# Altium schematic sheet Sheet2.SchDoc
size A3; DocumentNumber: 2; SheetNumber: 2; SheetTotal: 7
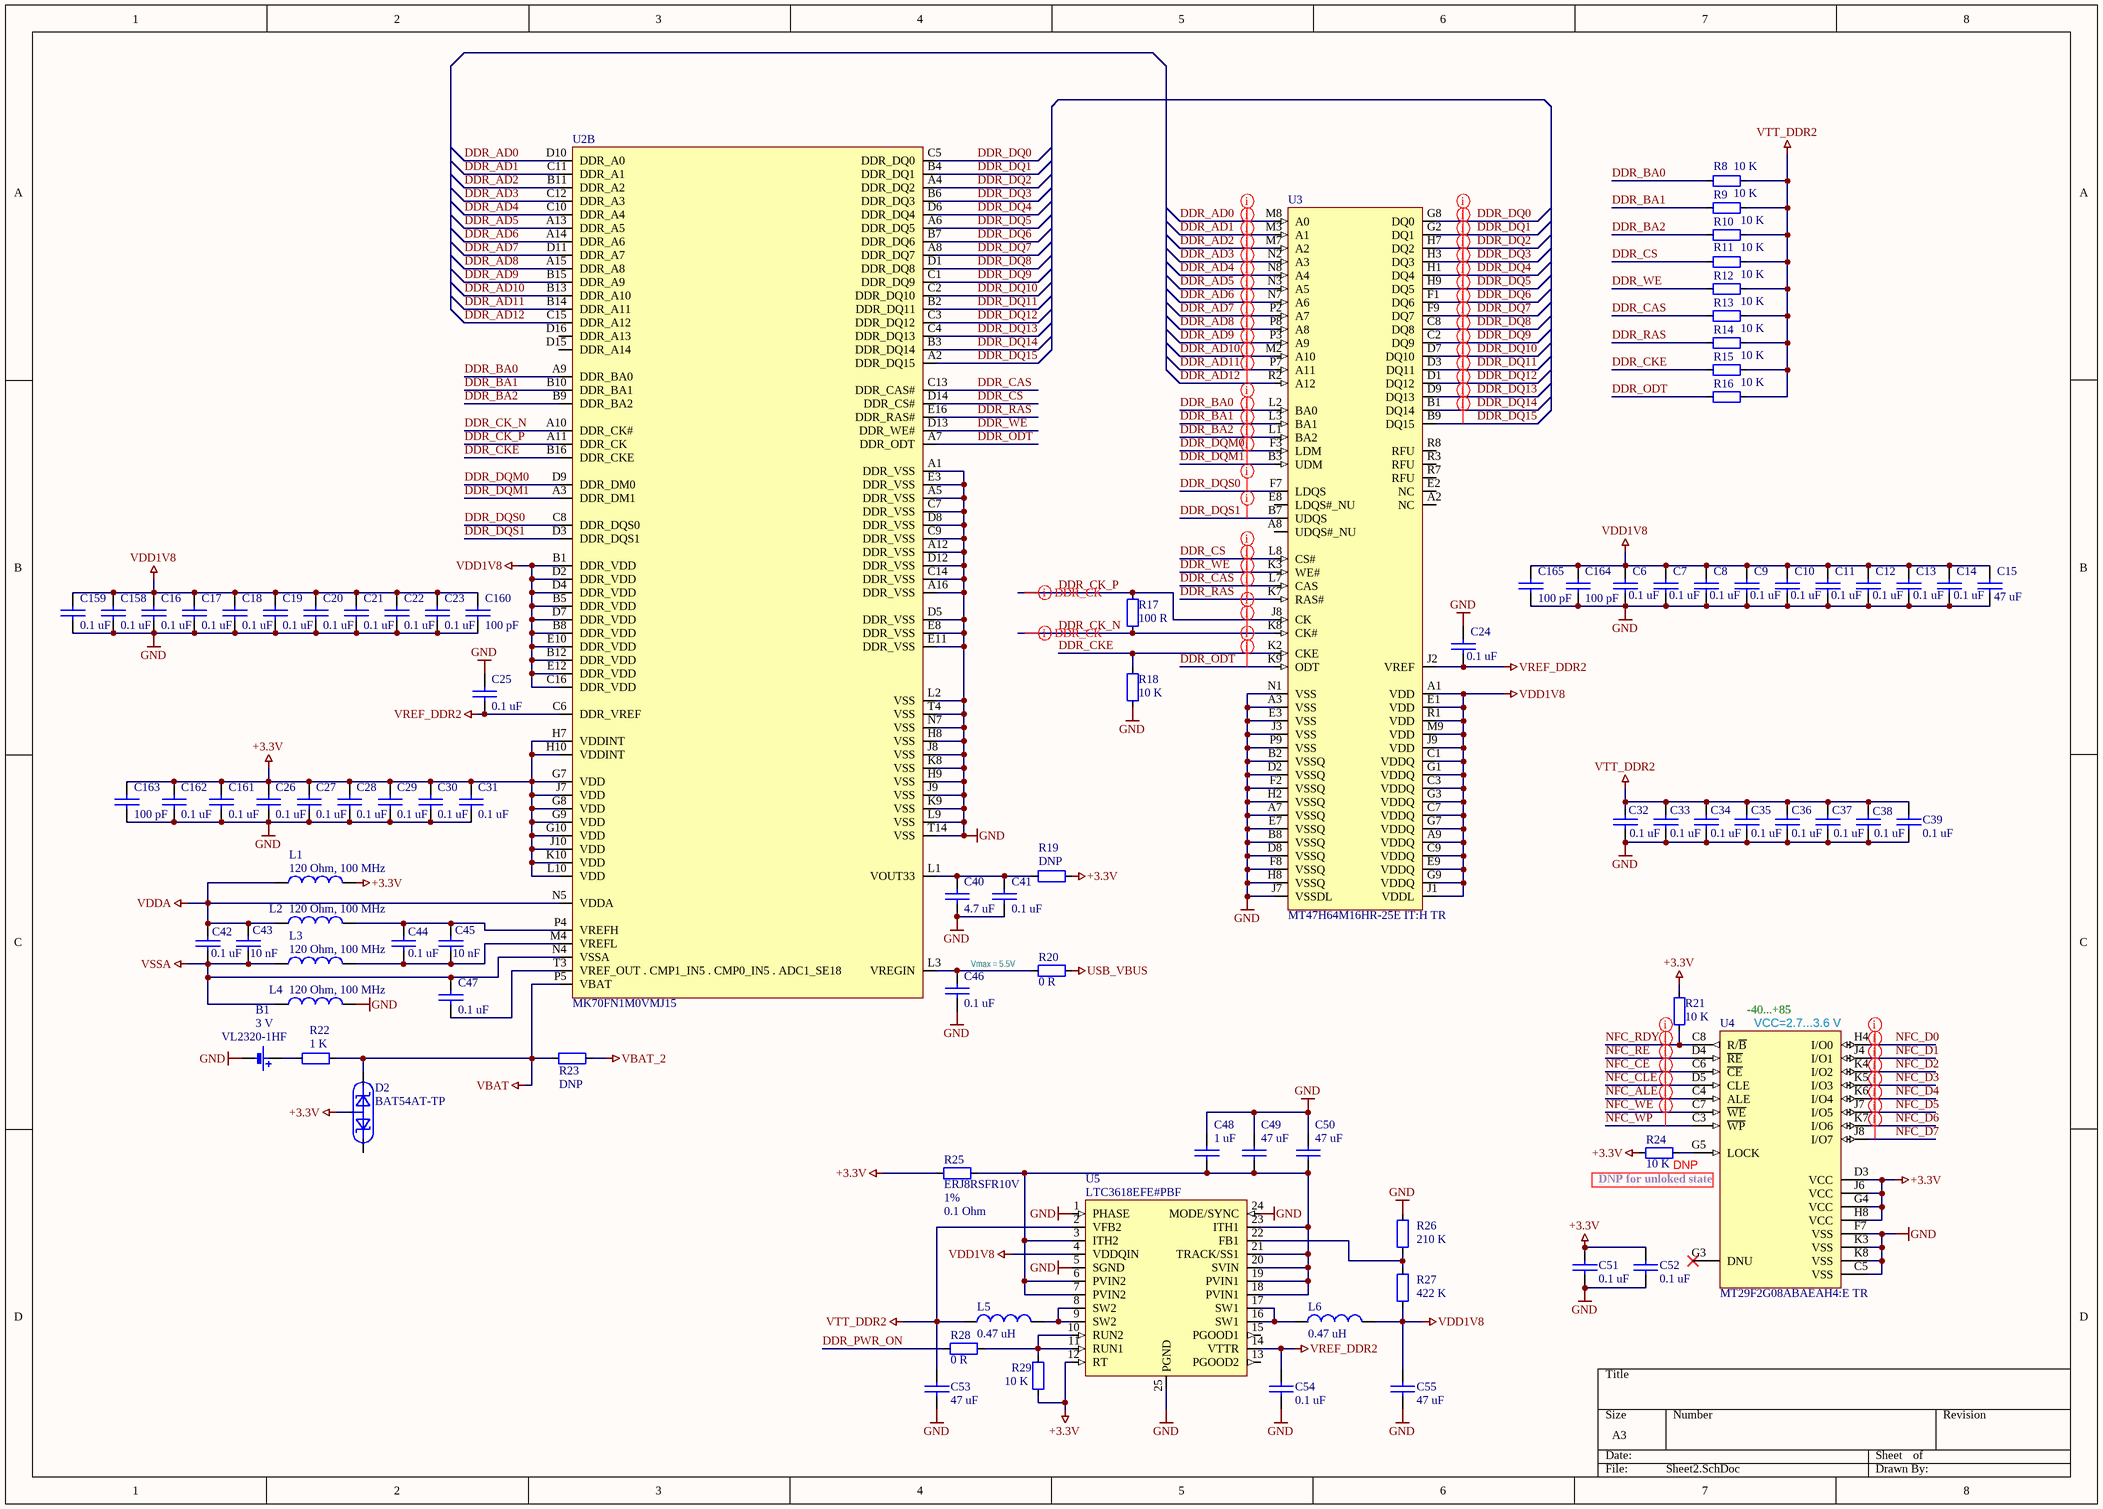
[diagram p0: Sheet2.SchDoc]

## Parts
B1  VL2320-1HF  value 3 V  [SANYO ML2430]
C6  value 0.1 uF  [1005[0402]]  (hidden comment: CL10B104KA8NNND)
C7  value 0.1 uF  [1005[0402]]  (hidden comment: CL10B104KA8NNND)
C8  value 0.1 uF  [1005[0402]]  (hidden comment: CL10B104KA8NNND)
C9  value 0.1 uF  [1005[0402]]  (hidden comment: CL10B104KA8NNND)
C10  value 0.1 uF  [1005[0402]]  (hidden comment: CL10B104KA8NNND)
C11  value 0.1 uF  [1005[0402]]  (hidden comment: CL10B104KA8NNND)
C12  value 0.1 uF  [1005[0402]]  (hidden comment: CL10B104KA8NNND)
C13  value 0.1 uF  [1005[0402]]  (hidden comment: CL10B104KA8NNND)
C14  value 0.1 uF  [1005[0402]]  (hidden comment: CL10B104KA8NNND)
C15  value 47 uF  [3225[1210]]  (hidden comment: GRM32ER71A476KE15L)
C16  value 0.1 uF  [1005[0402]]  (hidden comment: CL10B104KA8NNND)
C17  value 0.1 uF  [1005[0402]]  (hidden comment: CL10B104KA8NNND)
C18  value 0.1 uF  [1005[0402]]  (hidden comment: CL10B104KA8NNND)
C19  value 0.1 uF  [1005[0402]]  (hidden comment: CL10B104KA8NNND)
C20  value 0.1 uF  [1005[0402]]  (hidden comment: CL10B104KA8NNND)
C21  value 0.1 uF  [1005[0402]]  (hidden comment: CL10B104KA8NNND)
C22  value 0.1 uF  [1005[0402]]  (hidden comment: CL10B104KA8NNND)
C23  value 0.1 uF  [1005[0402]]  (hidden comment: CL10B104KA8NNND)
C24  value 0.1 uF  [1005[0402]]  (hidden comment: CL10B104KA8NNND)
C25  value 0.1 uF  [1005[0402]]  (hidden comment: CL10B104KA8NNND)
C26  value 0.1 uF  [1005[0402]]  (hidden comment: CL10B104KA8NNND)
C27  value 0.1 uF  [1005[0402]]  (hidden comment: CL10B104KA8NNND)
C28  value 0.1 uF  [1005[0402]]  (hidden comment: CL10B104KA8NNND)
C29  value 0.1 uF  [1005[0402]]  (hidden comment: CL10B104KA8NNND)
C30  value 0.1 uF  [1005[0402]]  (hidden comment: CL10B104KA8NNND)
C31  value 0.1 uF  [1005[0402]]  (hidden comment: CL10B104KA8NNND)
C32  value 0.1 uF  [1005[0402]]  (hidden comment: CL10B104KA8NNND)
C33  value 0.1 uF  [1005[0402]]  (hidden comment: CL10B104KA8NNND)
C34  value 0.1 uF  [1005[0402]]  (hidden comment: CL10B104KA8NNND)
C35  value 0.1 uF  [1005[0402]]  (hidden comment: CL10B104KA8NNND)
C36  value 0.1 uF  [1005[0402]]  (hidden comment: CL10B104KA8NNND)
C37  value 0.1 uF  [1005[0402]]  (hidden comment: CL10B104KA8NNND)
C38  value 0.1 uF  [1005[0402]]  (hidden comment: CL10B104KA8NNND)
C39  value 0.1 uF  [1005[0402]]  (hidden comment: CL10B104KA8NNND)
C40  value 4.7 uF  [1608[0603]]  (hidden comment: LMK107BJ475KA-T)
C41  value 0.1 uF  [1005[0402]]  (hidden comment: CL10B104KA8NNND)
C42  value 0.1 uF  [1005[0402]]  (hidden comment: CL10B104KA8NNND)
C43  value 10 nF  [1005[0402]]  (hidden comment: CL05B103KB5NNNC)
C44  value 0.1 uF  [1005[0402]]  (hidden comment: CL10B104KA8NNND)
C45  value 10 nF  [1005[0402]]  (hidden comment: CL05B103KB5NNNC)
C46  value 0.1 uF  [1005[0402]]  (hidden comment: CL10B104KA8NNND)
C47  value 0.1 uF  [1005[0402]]  (hidden comment: CL10B104KA8NNND)
C48  value 1 uF  [1608[0603]]  (hidden comment: CL10A105KO8NNNC)
C49  value 47 uF  [3225[1210]]  (hidden comment: GRM32ER71A476KE15L)
C50  value 47 uF  [3225[1210]]  (hidden comment: GRM32ER71A476KE15L)
C51  value 0.1 uF  [1608[0603]]  (hidden comment: CL10B104KA8NNND)
C52  value 0.1 uF  [1608[0603]]  (hidden comment: CL10B104KA8NNND)
C53  value 47 uF  [3225[1210]]  (hidden comment: GRM32ER71A476KE15L)
C54  value 0.1 uF  [1608[0603]]  (hidden comment: CL10B104KA8NNND)
C55  value 47 uF  [3225[1210]]  (hidden comment: GRM32ER71A476KE15L)
C158  value 0.1 uF  [1005[0402]]  (hidden comment: CL10B104KA8NNND)
C159  value 0.1 uF  [1005[0402]]  (hidden comment: CL10B104KA8NNND)
C160  value 100 pF  [1005[0402]]  (hidden comment: CL05C101JB5NNNC)
C161  value 0.1 uF  [1005[0402]]  (hidden comment: CL10B104KA8NNND)
C162  value 0.1 uF  [1005[0402]]  (hidden comment: CL10B104KA8NNND)
C163  value 100 pF  [1005[0402]]  (hidden comment: CL05C101JB5NNNC)
C164  value 100 pF  [1005[0402]]  (hidden comment: CL05C101JB5NNNC)
C165  value 100 pF  [1005[0402]]  (hidden comment: CL05C101JB5NNNC)
D2  BAT54AT-TP  [SOT-523F]
L1  value 120 Ohm, 100 MHz  [1005[0402]]  (hidden comment: MPZ1005S121C)
L2  value 120 Ohm, 100 MHz  [1005[0402]]  (hidden comment: MPZ1005S121C)
L3  value 120 Ohm, 100 MHz  [1005[0402]]  (hidden comment: MPZ1005S121C)
L4  value 120 Ohm, 100 MHz  [1005[0402]]  (hidden comment: MPZ1005S121C)
L5  value 0.47 uH  [IHLP-2020BZ-11]  (hidden comment: IHLP2020BZERR47M11)
L6  value 0.47 uH  [IHLP-2020BZ-11]  (hidden comment: IHLP2020BZERR47M11)
R8  value 10 K  [0402]  (hidden comment: ERJ-3EKF1002V)
R9  value 10 K  [0402]  (hidden comment: ERJ-3EKF1002V)
R10  value 10 K  [0402]  (hidden comment: ERJ-3EKF1002V)
R11  value 10 K  [0402]  (hidden comment: ERJ-3EKF1002V)
R12  value 10 K  [0402]  (hidden comment: ERJ-3EKF1002V)
R13  value 10 K  [0402]  (hidden comment: ERJ-3EKF1002V)
R14  value 10 K  [0402]  (hidden comment: ERJ-3EKF1002V)
R15  value 10 K  [0402]  (hidden comment: ERJ-3EKF1002V)
R16  value 10 K  [0402]  (hidden comment: ERJ-3EKF1002V)
R17  value 100 R  [0603]  (hidden comment: ERJ-3EKF1000V)
R18  value 10 K  [0402]  (hidden comment: ERJ-3EKF1002V)
R19  value DNP  [0603]  (hidden comment: DNP_0603)  (no BOM)
R20  value 0 R  [0603]  (hidden comment: RC0603JR-070RL)
R21  value 10 K  [0603]  (hidden comment: ERJ-3EKF1002V)
R22  value 1 K  [0603]  (hidden comment: RC0603FR-071KL)
R23  value DNP  [0603]  (hidden comment: DNP_0603)  (no BOM)
R24  value 10 K  [0603]  (hidden comment: ERJ-3EKF1002V)
R25  ERJ8RSFR10V  value 0.1 Ohm  Tolerance: 1%  [3216[1206]]
R26  value 210 K  [0603]  (hidden comment: RC0603FR-07210KL)
R27  value 422 K  [0603]  (hidden comment: RC0603FR-07422KL)
R28  value 0 R  [0603]  (hidden comment: RC0603JR-070RL)
R29  value 10 K  [0603]  (hidden comment: ERJ-3EKF1002V)
U2  MK70FN1M0VMJ15  [MAPBGA 256-pin]  (part B of 2)
U3  MT47H64M16HR-25E IT:H TR  [84-Ball BGA]
U4  MT29F2G08ABAEAH4:E TR  [63-BALL VFBGA]
U5  LTC3618EFE#PBF  [24-Lead Plastic TSSOP Linear]

## Nets
+3.3V: C26.2 C27.2 C28.2 C29.2 C30.2 C31.2 C51.2 C52.2 C161.2 C162.2 C163.1 D2.3 L1.2 R19.2 R21.1 R24.2 R25.1 R29.2 U2.G7(VDD) U2.G8(VDD) U2.G9(VDD) U2.G10(VDD) U2.H7(VDDINT) U2.H10(VDDINT) U2.J7(VDD) U2.J10(VDD) U2.K10(VDD) U2.L10(VDD) U4.D3(VCC) U4.G4(VCC) U4.H8(VCC) U4.J6(VCC) U5.12(RT)
GND: B1.1 C6.1 C7.1 C8.1 C9.1 C10.1 C11.1 C12.1 C13.1 C14.1 C15.2 C16.1 C17.1 C18.1 C19.1 C20.1 C21.1 C22.1 C23.1 C24.2 C25.2 C26.1 C27.1 C28.1 C29.1 C30.1 C31.1 C32.1 C33.1 C34.1 C35.1 C36.1 C37.1 C38.1 C39.1 C40.1 C41.1 C46.1 C48.2 C49.1 C50.1 C51.1 C52.1 C53.2 C54.1 C55.2 C158.1 C159.1 C160.2 C161.1 C162.1 C163.2 C164.2 C165.2 L4.2 R18.2 R26.2 U2.A1(DDR_VSS) U2.A5(DDR_VSS) U2.A12(DDR_VSS) U2.A16(DDR_VSS) U2.C7(DDR_VSS) U2.C9(DDR_VSS) U2.C14(DDR_VSS) U2.D5(DDR_VSS) U2.D8(DDR_VSS) U2.D12(DDR_VSS) U2.E3(DDR_VSS) U2.E8(DDR_VSS) U2.E11(DDR_VSS) U2.H8(VSS) U2.H9(VSS) U2.J8(VSS) U2.J9(VSS) U2.K8(VSS) U2.K9(VSS) U2.L2(VSS) U2.L9(VSS) U2.N7(VSS) U2.T4(VSS) U2.T14(VSS) U3.A3(VSS) U3.A7(VSSQ) U3.B2(VSSQ) U3.B8(VSSQ) U3.D2(VSSQ) U3.D8(VSSQ) U3.E3(VSS) U3.E7(VSSQ) U3.F2(VSSQ) U3.F8(VSSQ) U3.H2(VSSQ) U3.H8(VSSQ) U3.J3(VSS) U3.J7(VSSDL) U3.N1(VSS) U3.P9(VSS) U4.C5(VSS) U4.F7(VSS) U4.K3(VSS) U4.K8(VSS) U5.1(PHASE) U5.5(SGND) U5.24(MODE/SYNC) U5.25(PGND)
USB_VBUS: R20.2
VBAT: D2.2 R22.1 R23.1 U2.P5(VBAT)
VBAT_2: R23.2
VDD1V8: C6.2 C7.2 C8.2 C9.2 C10.2 C11.2 C12.2 C13.2 C14.2 C15.1 C16.2 C17.2 C18.2 C19.2 C20.2 C21.2 C22.2 C23.2 C55.1 C158.2 C159.2 C160.1 C164.1 C165.1 L6.2 R27.1 U2.B1(DDR_VDD) U2.B5(DDR_VDD) U2.B8(DDR_VDD) U2.B12(DDR_VDD) U2.C16(DDR_VDD) U2.D2(DDR_VDD) U2.D4(DDR_VDD) U2.D7(DDR_VDD) U2.E10(DDR_VDD) U2.E12(DDR_VDD) U3.A1(VDD) U3.A9(VDDQ) U3.C1(VDDQ) U3.C3(VDDQ) U3.C7(VDDQ) U3.C9(VDDQ) U3.E1(VDD) U3.E9(VDDQ) U3.G1(VDDQ) U3.G3(VDDQ) U3.G7(VDDQ) U3.G9(VDDQ) U3.J1(VDDL) U3.J9(VDD) U3.M9(VDD) U3.R1(VDD) U5.4(VDDQIN)
VDDA: C42.2 C43.1 L1.1 L2.1 U2.N5(VDDA)
VREF_DDR2: C24.1 C25.1 C54.2 U2.C6(DDR_VREF) U3.J2(VREF) U5.14(VTTR)
VSSA: C42.1 C43.2 C47.2 L3.1 L4.1 U2.N4(VSSA)
VTT_DDR2: C32.2 C33.2 C34.2 C35.2 C36.2 C37.2 C38.2 C39.2 C53.1 L5.1 R8.2 R9.2 R10.2 R11.2 R12.2 R13.2 R14.2 R15.2 R16.2 U5.2(VFB2)
DDR_AD0: U2.D10(DDR_A0) U3.M8(A0)
DDR_AD1: U2.C11(DDR_A1) U3.M3(A1)
DDR_AD2: U2.B11(DDR_A2) U3.M7(A2)
DDR_AD3: U2.C12(DDR_A3) U3.N2(A3)
DDR_AD4: U2.C10(DDR_A4) U3.N8(A4)
DDR_AD5: U2.A13(DDR_A5) U3.N3(A5)
DDR_AD6: U2.A14(DDR_A6) U3.N7(A6)
DDR_AD7: U2.D11(DDR_A7) U3.P2(A7)
DDR_AD8: U2.A15(DDR_A8) U3.P8(A8)
DDR_AD9: U2.B15(DDR_A9) U3.P3(A9)
DDR_AD10: U2.B13(DDR_A10) U3.M2(A10)
DDR_AD11: U2.B14(DDR_A11) U3.P7(A11)
DDR_AD12: U2.C15(DDR_A12) U3.R2(A12)
DDR_BA0: R8.1 U2.A9(DDR_BA0) U3.L2(BA0)
DDR_BA1: R9.1 U2.B10(DDR_BA1) U3.L3(BA1)
DDR_BA2: R10.1 U2.B9(DDR_BA2) U3.L1(BA2)
DDR_CAS: R13.1 U2.C13(DDR_CAS#) U3.L7(CAS)
DDR_CK_N: R17.2 U2.A10(DDR_CK#) U3.K8(CK#)
DDR_CK_P: R17.1 U2.A11(DDR_CK) U3.J8(CK)
DDR_CKE: R15.1 R18.1 U2.B16(DDR_CKE) U3.K2(CKE)
DDR_CS: R11.1 U2.D14(DDR_CS#) U3.L8(CS#)
DDR_DQ0: U2.C5(DDR_DQ0) U3.G8(DQ0)
DDR_DQ1: U2.B4(DDR_DQ1) U3.G2(DQ1)
DDR_DQ2: U2.A4(DDR_DQ2) U3.H7(DQ2)
DDR_DQ3: U2.B6(DDR_DQ3) U3.H3(DQ3)
DDR_DQ4: U2.D6(DDR_DQ4) U3.H1(DQ4)
DDR_DQ5: U2.A6(DDR_DQ5) U3.H9(DQ5)
DDR_DQ6: U2.B7(DDR_DQ6) U3.F1(DQ6)
DDR_DQ7: U2.A8(DDR_DQ7) U3.F9(DQ7)
DDR_DQ8: U2.D1(DDR_DQ8) U3.C8(DQ8)
DDR_DQ9: U2.C1(DDR_DQ9) U3.C2(DQ9)
DDR_DQ10: U2.C2(DDR_DQ10) U3.D7(DQ10)
DDR_DQ11: U2.B2(DDR_DQ11) U3.D3(DQ11)
DDR_DQ12: U2.C3(DDR_DQ12) U3.D1(DQ12)
DDR_DQ13: U2.C4(DDR_DQ13) U3.D9(DQ13)
DDR_DQ14: U2.B3(DDR_DQ14) U3.B1(DQ14)
DDR_DQ15: U2.A2(DDR_DQ15) U3.B9(DQ15)
DDR_DQM0: U2.D9(DDR_DM0) U3.F3(LDM)
DDR_DQM1: U2.A3(DDR_DM1) U3.B3(UDM)
DDR_DQS0: U2.C8(DDR_DQS0) U3.F7(LDQS)
DDR_DQS1: U2.D3(DDR_DQS1) U3.B7(UDQS)
DDR_ODT: R16.1 U2.A7(DDR_ODT) U3.K9(ODT)
DDR_PWR_ON: R28.1
DDR_RAS: R14.1 U2.E16(DDR_RAS#) U3.K7(RAS#)
DDR_WE: R12.1 U2.D13(DDR_WE#) U3.K3(WE#)
NFC_ALE: U4.C4(ALE)
NFC_CE: U4.C6(~{CE})
NFC_CLE: U4.D5(CLE)
NFC_D0: U4.H4(I/O0)
NFC_D1: U4.J4(I/O1)
NFC_D2: U4.K4(I/O2)
NFC_D3: U4.K5(I/O3)
NFC_D4: U4.K6(I/O4)
NFC_D5: U4.J7(I/O5)
NFC_D6: U4.K7(I/O6)
NFC_D7: U4.J8(I/O7)
NFC_RDY: R21.2 U4.C8(R/~{B})
NFC_RE: U4.D4(~{RE})
NFC_WE: U4.C7(~{WE})
NFC_WP: U4.C3(~{WP})
NetB1_2: B1.2 R22.2
NetC40_2: C40.2 C41.2 R19.1 U2.L1(VOUT33)
NetC44_1: C44.1 C45.2 L3.2 U2.M4(VREFL)
NetC44_2: C44.2 C45.1 L2.2 U2.P4(VREFH)
NetC46_2: C46.2 R20.1 U2.L3(VREGIN)
NetC47_1: C47.1 U2.T3(VREF_OUT_._CMP1_IN5_._CMP0_IN5_._ADC1_SE18)
NetC48_1: C48.1 C49.2 C50.2 R25.2 U5.3(ITH2) U5.6(PVIN2) U5.7(PVIN2) U5.18(PVIN1) U5.19(PVIN1) U5.20(SVIN) U5.21(TRACK/SS1) U5.23(ITH1)
NetL5_2: L5.2 U5.8(SW2) U5.9(SW2)
NetL6_1: L6.1 U5.16(SW1) U5.17(SW1)
NetR24_1: R24.1 U4.G5(LOCK)
NetR26_1: R26.1 R27.2 U5.22(FB1)
NetR28_2: R28.2 R29.1 U5.10(RUN2) U5.11(RUN1)

Not connected (* = marked no-connect by the designer): D2 1; U2 D15(DDR_A14) D16(DDR_A13); U3 A2(NC) A8(UDQS#_NU) E2(NC) E8(LDQS#_NU) R3(RFU) R7(RFU) R8(RFU); U4 G3(DNU)*; U5 13(PGOOD2) 15(PGOOD1)

## Layout directives
differential pair: DDR_CK_N, DDR_CK_P
net class DDR_DQ: DDR_DQ0, DDR_DQ1, DDR_DQ2, DDR_DQ3, DDR_DQ4, DDR_DQ5, DDR_DQ6, DDR_DQ7, DDR_DQ8, DDR_DQ9, DDR_DQ10, DDR_DQ11, DDR_DQ12, DDR_DQ13, DDR_DQ14, DDR_DQ15, DDR_DQM0, DDR_DQM1, DDR_DQS0, DDR_DQS1
net class DDR_ADDR: DDR_AD0, DDR_AD1, DDR_AD2, DDR_AD3, DDR_AD4, DDR_AD5, DDR_AD6, DDR_AD7, DDR_AD8, DDR_AD9, DDR_AD10, DDR_AD11, DDR_AD12, DDR_BA0, DDR_BA1, DDR_BA2, DDR_CAS, DDR_RAS, DDR_WE
net class DDR_CTRL: DDR_CKE, DDR_CS, DDR_ODT
net class DDR_CLOCK: DDR_CK_N, DDR_CK_P
net class NFC_DATA: NFC_D0, NFC_D1, NFC_D2, NFC_D3, NFC_D4, NFC_D5, NFC_D6, NFC_D7
net class NFC_CTRL: NFC_ALE, NFC_CE, NFC_CLE, NFC_RDY, NFC_RE, NFC_WE, NFC_WP

## Notes on the sheet
- Vmax = 5.5V
- (near U4) -40...+85
- (near U4) VCC=2.7...3.6 V
- (near U4) DNP for unloked state
- (near R24) DNP

## Library data of the parts
B1 = VL2320-1HF: Rechargeable Litium battery, Sanyo, 100 mAh, 3.1 V; PartNum: P083-ND; Manufacturer: Panasonic - BSG; Price: 5.85$; Distributor: Digi-Key; PartName: VL2320-1HF; Price50: 4.68$; Price100: 4.1$; Price1000: 3.51$
C6-C14 C16-C39 C41 C42 C44 C46 C47 C158 C159 C161 C162 = GRM155R71C104KA88D: 0.1 uF, 16V, 10%, X7R, 0402; Manufacturer: Murata; PartNum: 490-3261-1-ND; Tolerance: 10%; Distributor: Digi-Key; Price: 0.005$; Voltage: 16 V
C15 C49 C50 C53 C55 = GRM32ER71A476KE15L: 47.0 uF, 10V, 10%, X7R, 1210; Manufacturer: Murata Electronics North America; PartNum: 490-5312-2-ND; Tolerance: 10%; Price: 3.3; Distributor: Digi-Key; Voltage: 10V; PartName: GRM32ER71A476KE15L
C40 = LMK107BJ475KA-T: 4.7 uF, 10V, 10%, X5R, 0603; Manufacturer: Taiyo Yuden; PartNum: 587-1441-1-ND; Tolerance: +-10%; Distributor: Digi-Key; Price: 0.23$; PartName: LMK107BJ475KA-T; Voltage: 10 V
C43 C45 = GRM155R71C103KA01D_1: 10 nF, 16V, 10%, X7R, 0402; Manufacturer: SAMSUNG; Tolerance: 10%; Distributor: Future; Price: 0.02$; PartNum: CL05B103KB5NNNC; Voltage: 16 V; PartName: CL05B103KB5NNNC
C48 = GRM188R60J105KA01D: 1.0 uF, 16V, 10%, X5R, 0603; Manufacturer: SAMSUNG; Tolerance: 10%; Distributor: Future; Price: 0.0037 Euro; PartNum: CL10A105KO8NNNC; Voltage: 16 V; PartName: CL10A105KO8NNNC; Price50: 0.0037 Euro; Price100: 0.0037 Euro; Price1000: 0.0037 Euro
C51 C52 C54 = CVNF100K0603-25: 0.1 uF, 25V, 10% , X7R,  0603 SMD MLC Capacitor; Manufacturer: SAMSUNG; Tolerance: 10%; Distributor: Future; Price: 0.0026 Euro; PartNum: CL10B104KA8NNND; Voltage: 25 V; PartName: CL10B104KA8NNND; Price50: 0.0026 Euro; Price100: 0.0026 Euro; Price1000: 0.0026 Euro
C160 C163-C165 = GRM1555C1H101JZ01D_1: 100 pF, 50V 5% C0G 0402; Manufacturer: SAMSUNG; Tolerance: 5%; Price: 0.003$; Distributor: Future; PartNum: CL05C101JB5NNNC; Voltage: 50 V; PartName: CL05C101JB5NNNC
D2 = BAT54AT-TP: Schottky Diode, 30 V, 200 mA, common anode, SOT523; Manufacturer: Micro Commercial Co; PartNum: BAT54AT-TPDKR-ND; Distributor: Digi-Key; Price: 0.52$; PartName: BAT54AT-TP
L1-L4 = MPZ1005S121C: Ferrite bead, 120 Ohm, 100 MHz,  1.2 A, 0.09 Ohm, 0402; Manufacturer: TDK Corporation; PartNum: 445-2981-1-ND; Distributor: Digi-Key; Price: 0.1$; PartName: MPZ1005S121C
L5 L6 = IHLP2020BZERR47M11: Inductors 0.47H, 8 A, 7 mOhms, +-20%,- 55 C to + 125 C; Manufacturer: Vishay Dale; PartNum: 541-1215-2-ND; Tolerance: ±20%; Distributor: Digi-Key; Price: 3.2; PartName: IHLP2020BZERR47M11
R8-R16 R18 = RC0402JR-0710KL: 10 K, 5%, 0402, SMD Resistor, Taped; Manufacturer: Yageo; PartNum: 311-10KJRCT-ND; Voltage: 75 V; Distributor: Digi-Key; Price: 0.1$; Tolerance: 5%; PartName: RC0402JR-0710KL
R17 = RL0603E100-1: 100 R, 1%, 0603, SMD Resistor, Taped; Manufacturer: PANASONIC; Voltage: 75 V; Distributor: Future; Price: 0.0017$; Tolerance: 1%; PartNum: ERJ-3EKF1000V; PartName: ERJ-3EKF1000V; Price50: 0.0015 Euro; Price100: 0.0015 Euro; Price1000: 0.0015 Euro
R19 R23 = DNP_0603: DNP, 0603
R20 R28 = RL0603E000: 0 R, 5%, 0603, SMD Resistor, Taped; Manufacturer: YAGEO AMERICA CORPORATION; Voltage: 75 V; Distributor: Future; Price: 0.0017$; Tolerance: 5%; PartNum: RC0603JR-070RL; PartName: RC0603JR-070RL; Price50: 0.0017$; Price100: 0.0017$; Price1000: 0.0017$
R21 R24 R29 = RL0603K010-1: 10 K, 1%, 0603, SMD Resistor, Taped; Manufacturer: PANASONIC; Voltage: 75 V; Distributor: Future; Price: 0.0015 Euro; Tolerance: 1%; PartNum: ERJ-3EKF1002V; PartName: ERJ-3EKF1002V; Price50: 0.0015 Euro; Price100: 0.0015 Euro; Price1000: 0.0015 Euro
R22 = RL0603K001-1: 1 K, 1%, 0603, SMD Resistor, Taped; Manufacturer: YAGEO AMERICA CORPORATION; Voltage: 75 V; Distributor: Future; Price: 0.0017$; Tolerance: 1%; PartNum: RC0603FR-071KL; PartName: RC0603FR-071KL; Price50: 0.0017$; Price100: 0.0017$; Price1000: 0.0017$
R25 = ERJ8RSFR10V: 0.1 Ohm, 0.25 W, 1% 1206; Manufacturer: Panasonic; Distributor: Farnell; Price: 1.06; PartNum: ERJ8RSFR10V
R26 = RC0603FR-07210KL: 210 K, 1%, 0603, SMD Resistor; Manufacturer: Yageo; PartNum: 311-210KHRTR-ND; Voltage: 75 V; Distributor: Digi-Key; Price: 0.004; Tolerance: 1%; PartName: RC0603FR-07210KL
R27 = RC0603FR-07422KL: 422 K, 1%, 0603, SMD Resistor; Manufacturer: Yageo; PartNum: 311-422KHRTR-ND; Voltage: 75 V; Distributor: Digi-Key; Price: 0.004; Tolerance: 1%; PartName: RC0603FR-07422KL
U2 = MK70FN1M0VMJ15: 32-Bit 150 Mhz ARM 1MB FLASH 256MAPBGA; Manufacturer: Freescale; PartNum: MK70FN1M0VMJ15-ND; PartName: MK70FN1M0VMJ15; Price: 16.5$; Distributor: Digi-Key
U3 = MT47H64M16HR-25E IT:H TR: IC DDR2 SDRAM 1GBIT 2.5NS 84FBGA; Manufacturer: Micron Technology Inc; PartNum: 557-1522-1-ND; Distributor: Digi-Key; PartName: MT47H64M16HR-25E IT:H TR
U4 = MT29F2G08ABAEAH4:E TR: NAND FLASH 2GB 1.8V 63-VFBGA; Manufacturer: Micron Technology Inc; PartNum: 557-1486-1-ND; Ordered: Digi-Key; Price: 5.8$; Distributor: AVNET; Price50: 3.51$; Price100: 3.51$; Price1000: 3.51$; PartName: MT29F2G08ABAEAH4:E
U5 = LTC3618EFE#PBF: IC REG DUAL SYNC 3A BUCK 24TSSOP; Manufacturer: Linear Technology; PartNum: LTC3618EFE#PBF-ND; Distributor: Digi-Key; PartName: LTC3618EFE#PBF; price: 6.4$